# EAGLE design MainPCB_1P (EAGLE 9.4.2)
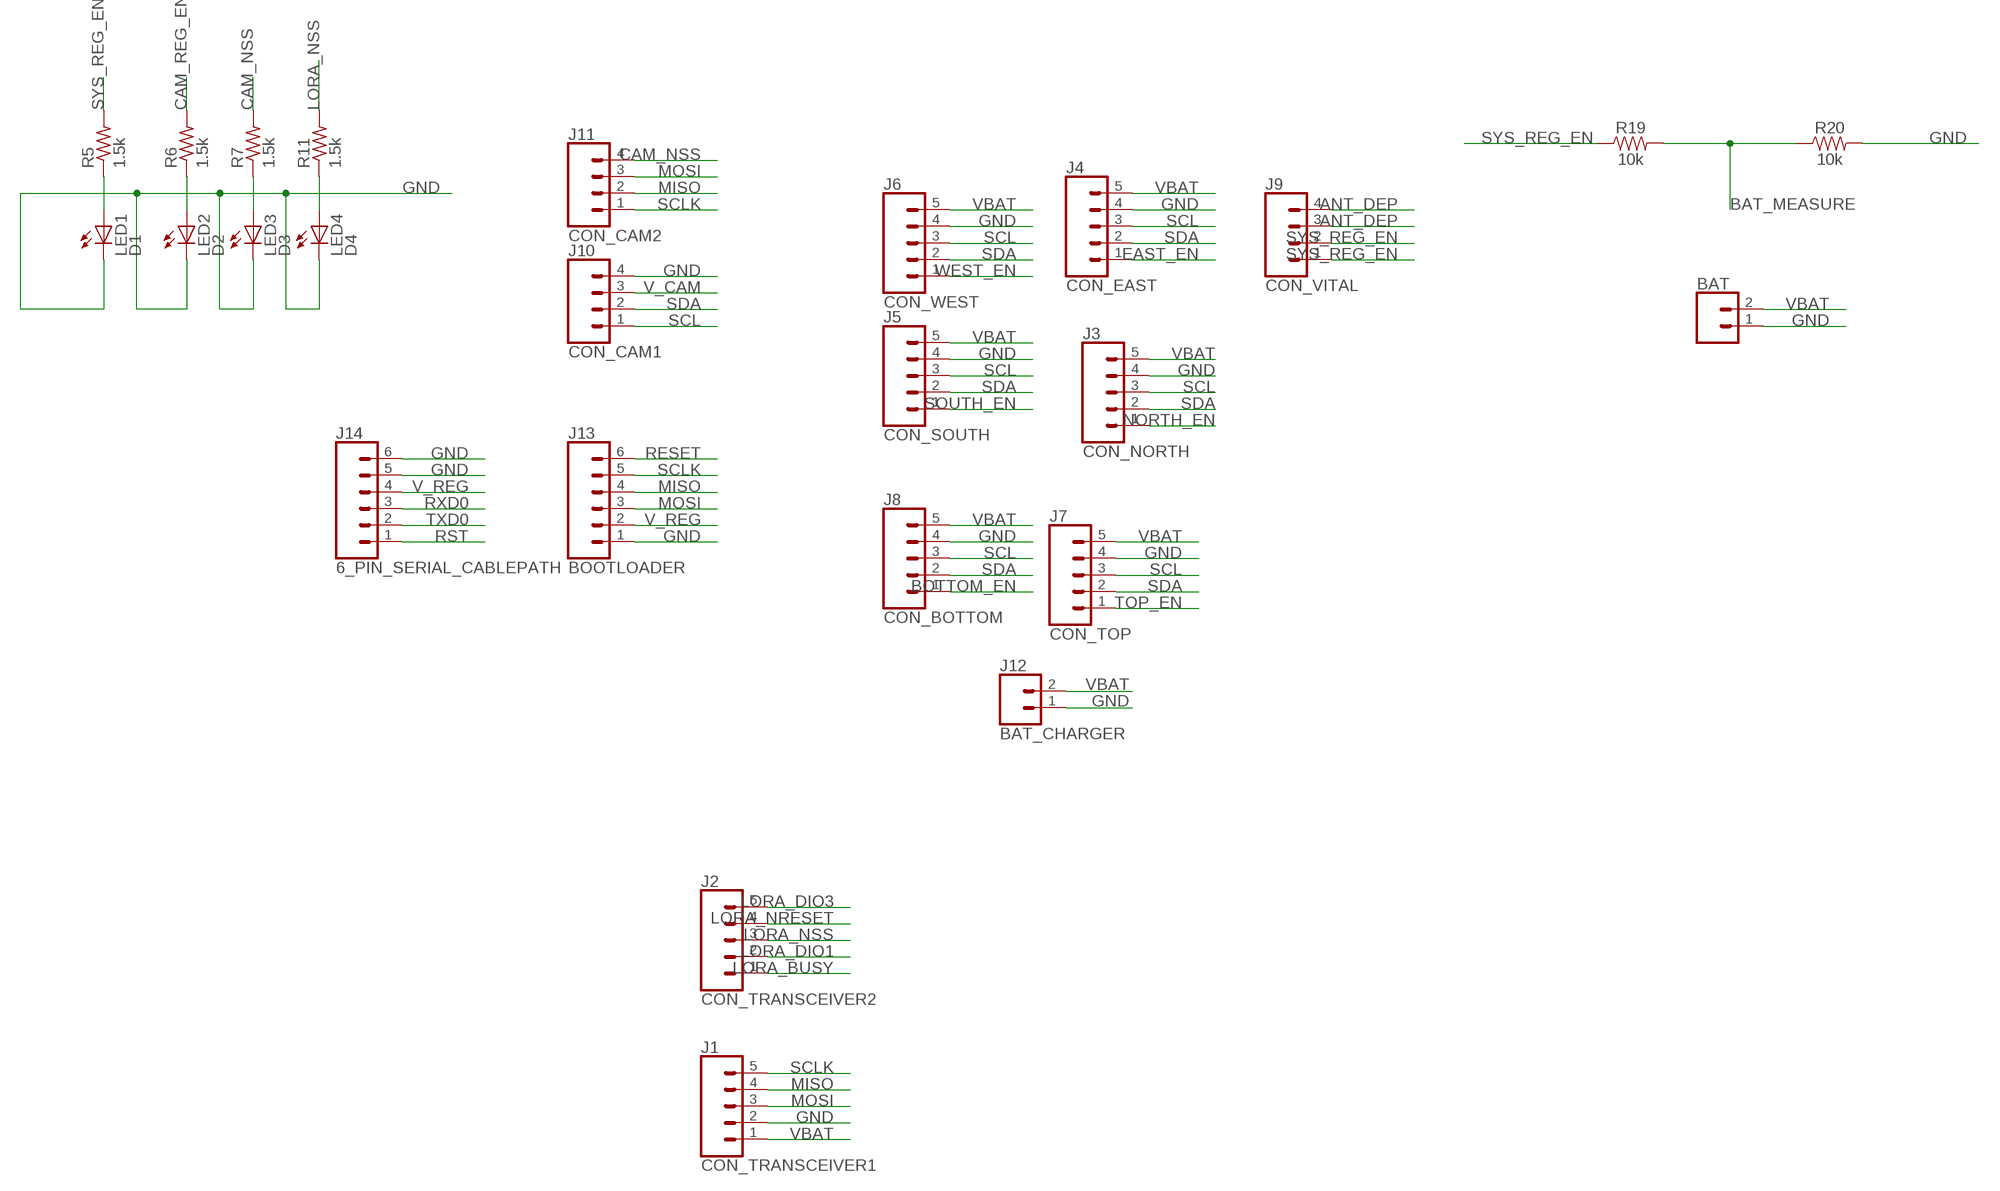
[diagram p0: schematic, sheet 1, part 1 of 2]
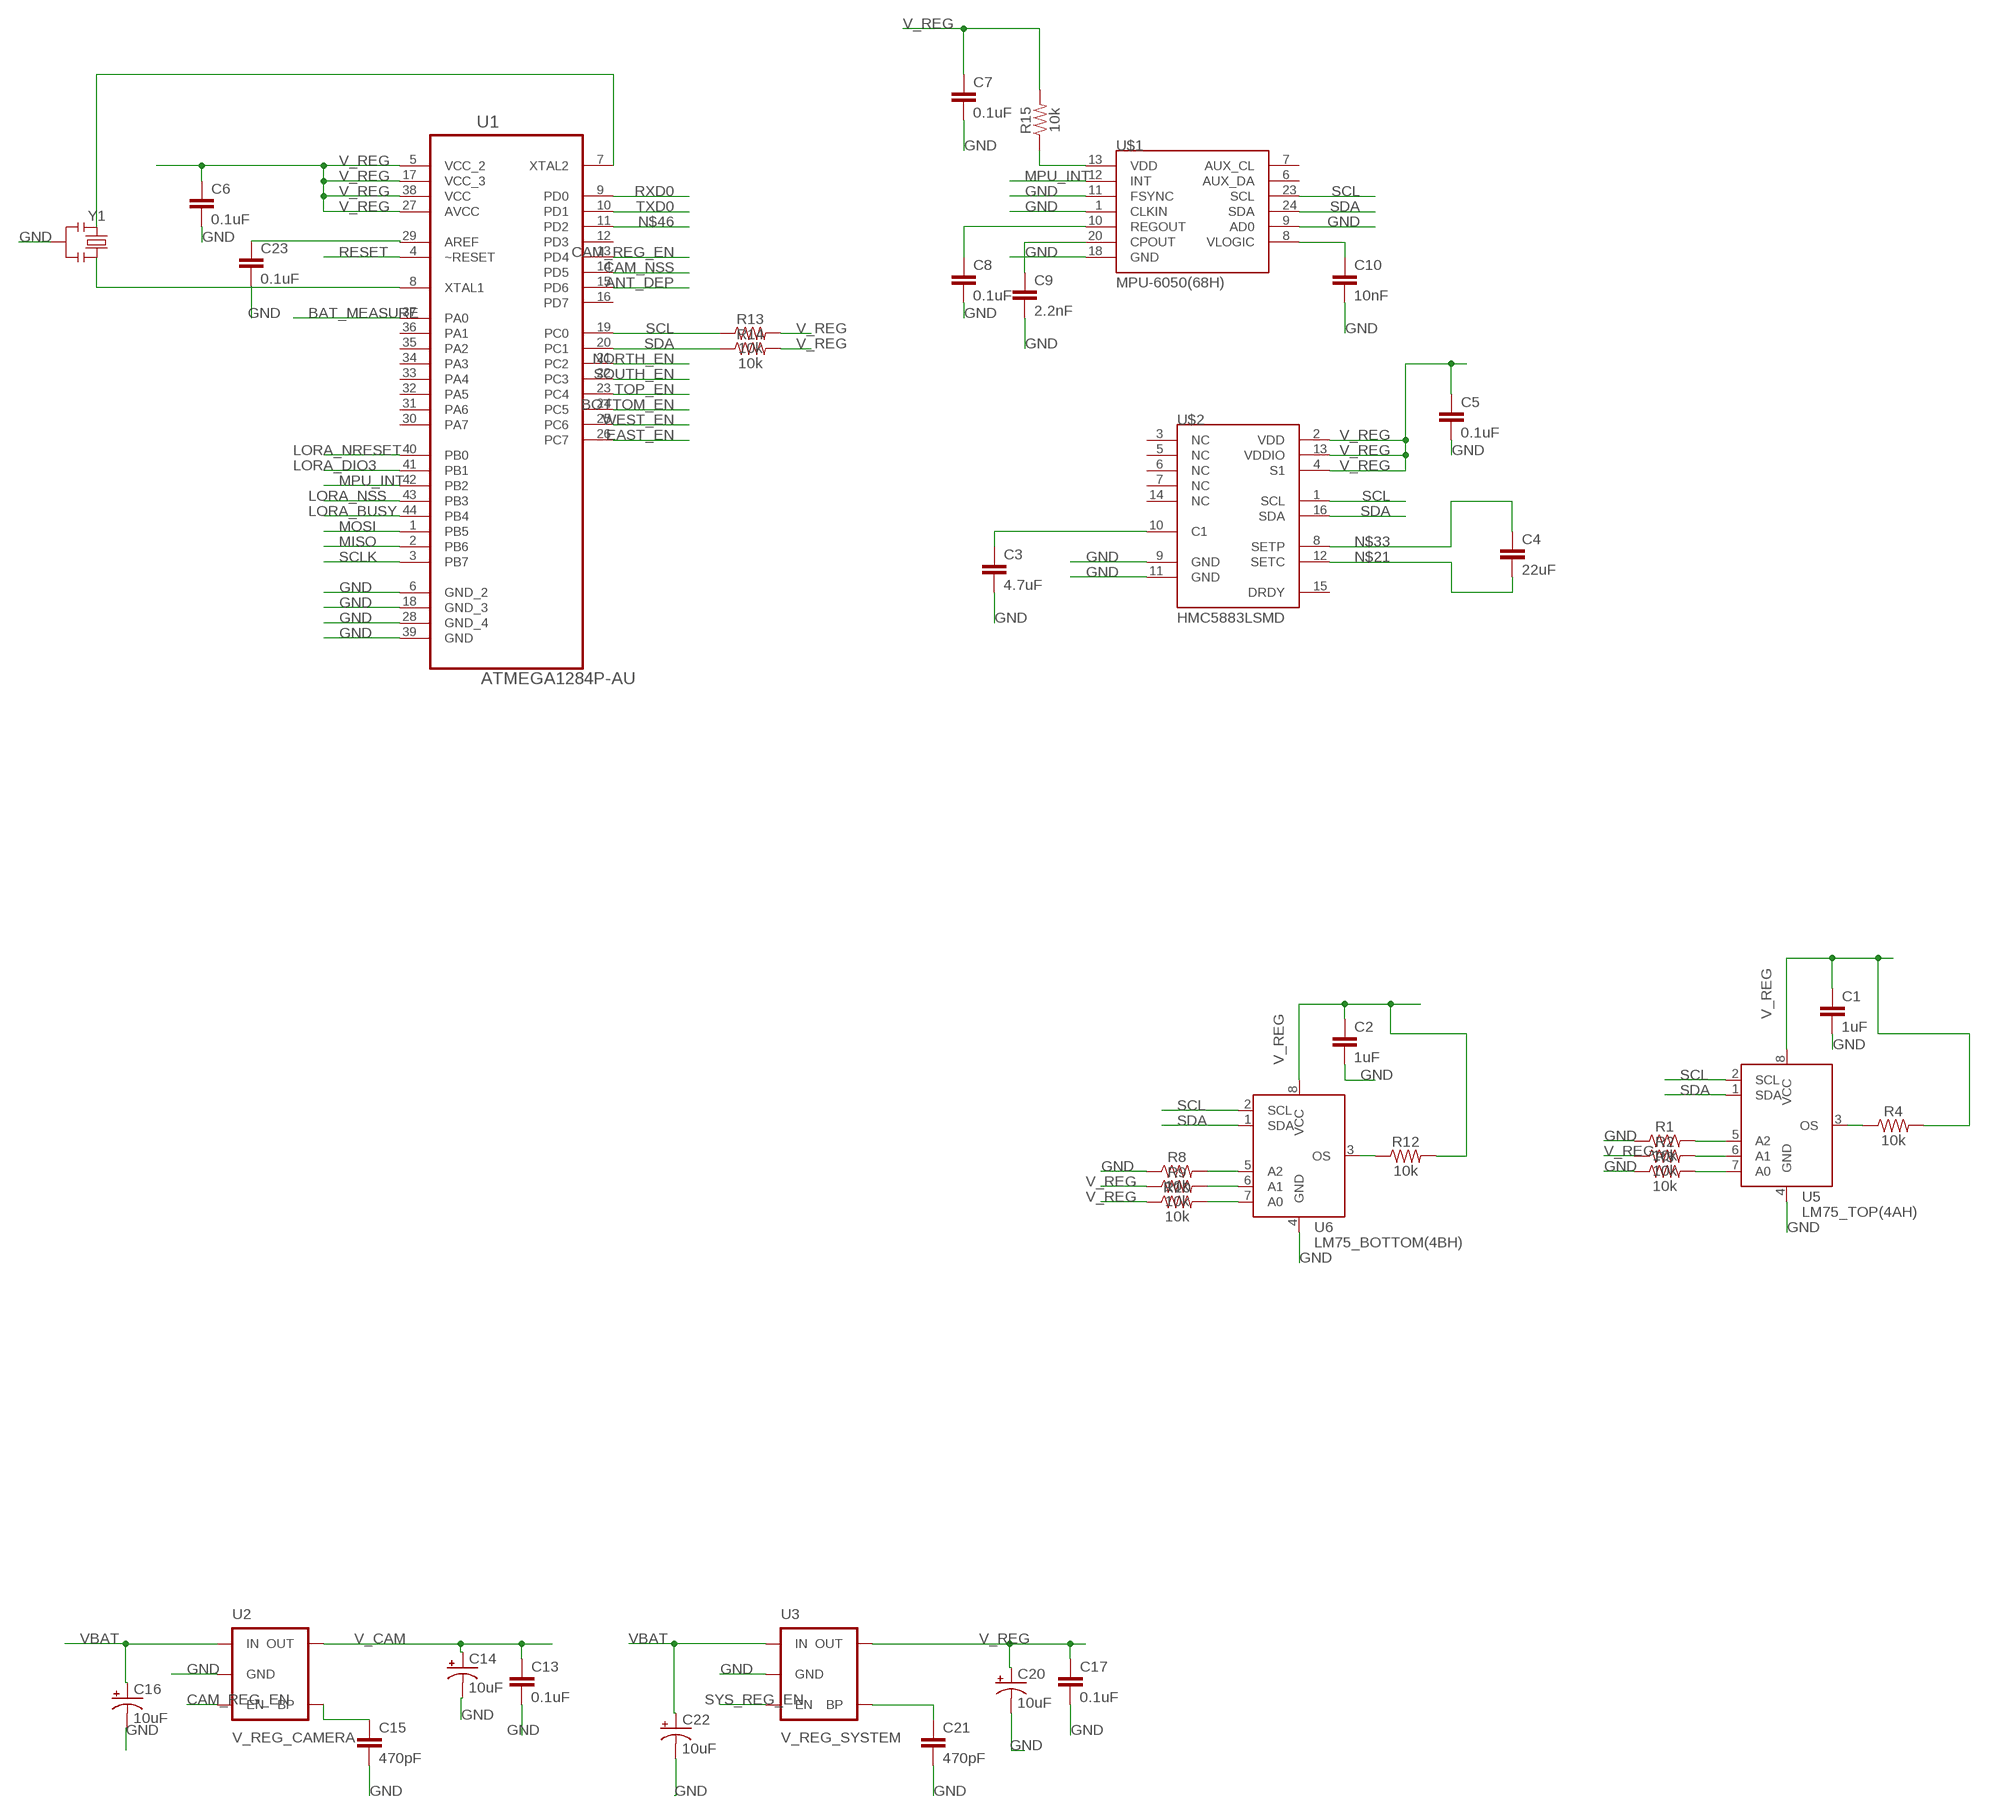
[diagram p1: schematic, sheet 1, part 2 of 2]

## Parts
BAT  CONN_02  [1X02]
C1  1uF  0.1UF-0603-25V-5%  [0603]
C2  1uF  0.1UF-0603-25V-5%  [0603]
C3  4.7uF  4.7UF-0603-35V-(20%)  [0603]
C4  22uF  22UF-0603-6.3V-20%  [0603]
C5  0.1uF  0.1UF-0603-100V-10%  [0603]
C6  0.1uF  0.1UF-0603-100V-10%  [0603]
C7  0.1uF  0.1UF-0603-100V-10%  [0603]
C8  0.1uF  0.1UF-0603-100V-10%  [0603]
C9  2.2nF  0.1UF-0603-100V-10%  [0603]
C10  10nF  0.1UF-0603-100V-10%  [0603]
C13  0.1uF  0.1UF-0603-100V-10%  [0603]
C14  10uF  10UF-POLAR-0603-6.3V-20%(TANT)  [0603-POLAR]
C15  470pF  0.1UF-0603-100V-10%  [0603]
C16  10uF  10UF-POLAR-0603-6.3V-20%(TANT)  [0603-POLAR]
C17  0.1uF  0.1UF-0603-100V-10%  [0603]
C20  10uF  10UF-POLAR-0603-6.3V-20%(TANT)  [0603-POLAR]
C21  470pF  0.1UF-0603-100V-10%  [0603]
C22  10uF  10UF-POLAR-0603-6.3V-20%(TANT)  [0603-POLAR]
C23  0.1uF  CAP0603-CAP  [0603-CAP]
J1  CON_TRANSCEIVER1  CONN_051.27MM  [1X05_1.27MM]
J2  CON_TRANSCEIVER2  CONN_051.27MM  [1X05_1.27MM]
J3  CON_NORTH  CONN_051.27MM  [1X05_1.27MM]
J4  CON_EAST  CONN_051.27MM  [1X05_1.27MM]
J5  CON_SOUTH  CONN_051.27MM  [1X05_1.27MM]
J6  CON_WEST  CONN_051.27MM  [1X05_1.27MM]
J7  CON_TOP  CONN_051.27MM  [1X05_1.27MM]
J8  CON_BOTTOM  CONN_051.27MM  [1X05_1.27MM]
J9  CON_VITAL  CONN_041.27MM  [1X04_1.27MM]
J10  CON_CAM1  CONN_041.27MM  [1X04_1.27MM]
J11  CON_CAM2  CONN_041.27MM  [1X04_1.27MM]
J12  BAT_CHARGER  CONN_021X02_NO_SILK  [1X02_NO_SILK]
J13  BOOTLOADER  CONN_061.27MM  [1X06_1.27MM]
J14  6_PIN_SERIAL_CABLEPATH  CONN_061.27MM  [1X06_1.27MM]
LED1  D1  LEDCHIP-LED0603  [CHIP-LED0603]
LED2  D2  LEDCHIP-LED0603  [CHIP-LED0603]
LED3  D3  LEDCHIP-LED0603  [CHIP-LED0603]
LED4  D4  LEDCHIP-LED0603  [CHIP-LED0603]
R1  10k  RESISTOR0603  [0603]
R2  10k  RESISTOR0603  [0603]
R3  10k  RESISTOR0603  [0603]
R4  10k  RESISTOR0603  [0603]
R5  1.5k  R-US_R0603  [R0603]
R6  1.5k  R-US_R0603  [R0603]
R7  1.5k  R-US_R0603  [R0603]
R8  10k  RESISTOR0603  [0603]
R9  10k  RESISTOR0603  [0603]
R10  10k  RESISTOR0603  [0603]
R11  1.5k  R-US_R0603  [R0603]
R12  10k  RESISTOR0603  [0603]
R13  10k  RESISTOR0603  [0603]
R14  10k  RESISTOR0603  [0603]
R15  10k  RESISTOR0603  [0603]
R19  10k  1KOHM-0603-1/10W-1%  [0603]
R20  10k  1KOHM-0603-1/10W-1%  [0603]
U1  ATMEGA1284P-AU  [QFP80P1200X1200X120-44N]
U2  V_REG_CAMERA  V_REG_LDOSMD  [SOT23-5]
U3  V_REG_SYSTEM  V_REG_LDOSMD  [SOT23-5]
U5  LM75_TOP(4AH)  LM75BDP  [SOT505-1]
U6  LM75_BOTTOM(4BH)  LM75BDP  [SOT505-1]
U$1  MPU-6050(68H)  MPU-6050-1  [QFN-24-4MM2]
U$2  HMC5883LSMD  [16LPCC]
Y1  RESONATORSMD  [RESONATOR-SMD]

## Nets
ANT_DEP: J9.3 J9.4 U1.15(PD6)
BAT_MEASURE: R19.2 R20.1 U1.37(PA0)
BOTTOM_EN: J8.1 U1.24(PC5)
CAM_NSS: J11.4 R7.2 U1.14(PD5)
CAM_REG_EN: R6.2 U1.13(PD4) U2.3(EN)
EAST_EN: J4.1 U1.26(PC7)
GND: BAT.1 C1.2 C2.2 C3.2 C5.2 C6.2 C7.2 C8.2 C9.2 C10.2 C13.2 C14.- C15.2 C16.- C17.2 C20.- C21.2 C22.- C23.2 J1.2 J3.4 J4.4 J5.4 J6.4 J7.4 J8.4 J10.4 J12.1 J13.1 J14.5 J14.6 LED1.C LED2.C LED3.C LED4.C R1.1 R3.1 R8.1 R20.2 U1.6(GND_2) U1.18(GND_3) U1.28(GND_4) U1.39(GND) U2.2(GND) U3.2(GND) U5.4(GND) U6.4(GND) U$1.1(CLKIN) U$1.9(AD0) U$1.11(FSYNC) U$1.18(GND) U$2.9(GND) U$2.11(GND) Y1.2
LORA_BUSY: J2.1 U1.44(PB4)
LORA_DIO1: J2.2
LORA_DIO3: J2.5 U1.41(PB1)
LORA_NRESET: J2.4 U1.40(PB0)
LORA_NSS: J2.3 R11.2 U1.43(PB3)
MISO: J1.4 J11.2 J13.4 U1.2(PB6)
MOSI: J1.3 J11.3 J13.3 U1.1(PB5)
MPU_INT: U1.42(PB2) U$1.12(INT)
N$1: C23.1 U1.29(AREF)
N$2: R1.2 U5.5(A2)
N$4: U1.7(XTAL2) Y1.1
N$5: U1.8(XTAL1) Y1.3
N$7: C3.1 U$2.10(C1)
N$8: C9.1 U$1.20(CPOUT)
N$9: C8.1 U$1.10(REGOUT)
N$10: R15.1 U$1.13(VDD)
N$11: R2.2 U5.6(A1)
N$13: C10.1 U$1.8(VLOGIC)
N$14: R8.2 U6.5(A2)
N$15: R9.2 U6.6(A1)
N$16: R10.2 U6.7(A0)
N$17: R3.2 U5.7(A0)
N$21: C4.2 U$2.12(SETC)
N$24: R4.1 U5.3(OS)
N$27: C21.1 U3.4(BP)
N$28: LED1.A R5.1
N$29: LED2.A R6.1
N$30: C15.1 U2.4(BP)
N$31: LED3.A R7.1
N$32: LED4.A R11.1
N$33: C4.1 U$2.8(SETP)
N$46: U1.11(PD2)
N$52: R12.1 U6.3(OS)
NORTH_EN: J3.1 U1.21(PC2)
RESET: J13.6 U1.4(~RESET)
RST: J14.1
RXD0: J14.3 U1.9(PD0)
SCL: J3.3 J4.3 J5.3 J6.3 J7.3 J8.3 J10.1 R13.1 U1.19(PC0) U5.2(SCL) U6.2(SCL) U$1.23(SCL) U$2.1(SCL)
SCLK: J1.5 J11.1 J13.5 U1.3(PB7)
SDA: J3.2 J4.2 J5.2 J6.2 J7.2 J8.2 J10.2 R14.1 U1.20(PC1) U5.1(SDA) U6.1(SDA) U$1.24(SDA) U$2.16(SDA)
SOUTH_EN: J5.1 U1.22(PC3)
SYS_REG_EN: J9.1 J9.2 R5.2 R19.1 U3.3(EN)
TOP_EN: J7.1 U1.23(PC4)
TXD0: J14.2 U1.10(PD1)
V_CAM: C13.1 C14.+ J10.3 U2.5(OUT)
V_REG: C1.1 C2.1 C5.1 C6.1 C7.1 C17.1 C20.+ J13.2 J14.4 R2.1 R4.2 R9.1 R10.1 R12.2 R13.2 R14.2 R15.2 U1.5(VCC_2) U1.17(VCC_3) U1.27(AVCC) U1.38(VCC) U3.5(OUT) U5.8(VCC) U6.8(VCC) U$2.2(VDD) U$2.4(S1) U$2.13(VDDIO)
VBAT: BAT.2 C16.+ C22.+ J1.1 J3.5 J4.5 J5.5 J6.5 J7.5 J8.5 J12.2 U2.1(IN) U3.1(IN)
WEST_EN: J6.1 U1.25(PC6)
Unconnected: U1.12(PD3) U1.16(PD7) U1.30(PA7) U1.31(PA6) U1.32(PA5) U1.33(PA4) U1.34(PA3) U1.35(PA2) U1.36(PA1) U$1.6(AUX_DA) U$1.7(AUX_CL) U$2.3(NC) U$2.5(NC) U$2.6(NC) U$2.7(NC) U$2.14(NC) U$2.15(DRDY)

## Library data of the parts
BAT J12 = SparkFun-Connectors:CONN_02: Multi connection point. Often used as Generic Header-pin footprint for 0.1 inch spaced/style header connections On any of the 0.1 inch spaced packages, you can populate with these: Break Away Headers - Straight <https://www.sparkfun.com/products/116> (PRT-00116) Break Away Male Headers - Right Angle <https://www.sparkfun.com/products/553> (PRT-00553) Female Headers <https://www.sparkfun.com/products/115> (PRT-00115) Break Away Headers - Machine Pin <https://www.sparkfun.com/products/117> (PRT-00117) Break Away Female Headers - Swiss Machine Pin <https://www.sparkfun.com/products/743> (PRT-00743) For SCREWTERMINALS and SPRING TERMINALS visit here: Screw Terimnals on SparkFun.com <https://www.sparkfun.com/search/results?term=Screw+Terminals> (5mm/3.5mm/2.54mm spacing) This device is also useful as a general connection point to wire up your design to another part of your project. Our various solder wires solder well into these plated through hole pads. Hook-Up Wire - Assortment (Stranded, 22 AWG) <https://www.sparkfun.com/products/11375> (PRT-11375) Hook-Up Wire - Assortment (Solid Core, 22 AWG) <https://www.sparkfun.com/products/11367> (PRT-11367) View the entire wire category on our website here <https://www.sparkfun.com/categories/141> Special notes: Molex polarized connector foot print use with: PRT-08233 with associated crimp pins and housings. 2.54_SCREWTERM for use with PRT-10571. 3.5mm Screw Terminal footprints for PRT-08084 5mm Screw Terminal footprints for use with PRT-08432
C1 C2 = SparkFun-Capacitors:0.1UF: 0.1µF ceramic capacitors A capacitor is a passive two-terminal electrical component used to store electrical energy temporarily in an electric field.; PROD_ID: CAP-08604; VALUE: 0.1uF
C3 = SparkFun-Capacitors:4.7UF: 4.7µF ceramic capacitors A capacitor is a passive two-terminal electrical component used to store electrical energy temporarily in an electric field.; PROD_ID: CAP-14106
C4 = SparkFun-Capacitors:22UF: 22µF ceramic capacitors A capacitor is a passive two-terminal electrical component used to store electrical energy temporarily in an electric field.; PROD_ID: CAP-14464
C5-C8 C13 C17 = SparkFun-Capacitors:0.1UF: 0.1µF ceramic capacitors A capacitor is a passive two-terminal electrical component used to store electrical energy temporarily in an electric field.; PROD_ID: CAP-08390
C9 C10 C15 C21 = SparkFun-Capacitors:0.1UF: 0.1µF ceramic capacitors A capacitor is a passive two-terminal electrical component used to store electrical energy temporarily in an electric field.; PROD_ID: CAP-08390; VALUE: 0.1uF
C14 C16 C20 C22 = SparkFun-Capacitors:10UF-POLAR: 10.0µF polarized capacitors A capacitor is a passive two-terminal electrical component used to store electrical energy temporarily in an electric field.; PROD_ID: CAP-13210
C23 = SparkFun:CAP: Capacitor Standard 0603 ceramic capacitor, and 0.1" leaded capacitor.
J1-J8 = SparkFun-Connectors:CONN_05: Multi connection point. Often used as Generic Header-pin footprint for 0.1 inch spaced/style header connections On any of the 0.1 inch spaced packages, you can populate with these: Break Away Headers - Straight <https://www.sparkfun.com/products/116> (PRT-00116) Break Away Male Headers - Right Angle <https://www.sparkfun.com/products/553> (PRT-00553) Female Headers <https://www.sparkfun.com/products/115> (PRT-00115) Break Away Headers - Machine Pin <https://www.sparkfun.com/products/117> (PRT-00117) Break Away Female Headers - Swiss Machine Pin <https://www.sparkfun.com/products/743> (PRT-00743) For SCREWTERMINALS and SPRING TERMINALS visit here: Screw Terimnals on SparkFun.com <https://www.sparkfun.com/search/results?term=Screw+Terminals> (5mm/3.5mm/2.54mm spacing) This device is also useful as a general connection point to wire up your design to another part of your project. Our various solder wires solder well into these plated through hole pads. Hook-Up Wire - Assortment (Stranded, 22 AWG) <https://www.sparkfun.com/products/11375> (PRT-11375) Hook-Up Wire - Assortment (Solid Core, 22 AWG) <https://www.sparkfun.com/products/11367> (PRT-11367) View the entire wire category on our website here <https://www.sparkfun.com/categories/141> Special notes: Molex polarized connector foot print use with SKU : PRT-08231 with associated crimp pins and housings. 1MM SMD Version SKU: PRT-10208
J9-J11 = SparkFun-Connectors:CONN_04: Multi connection point. Often used as Generic Header-pin footprint for 0.1 inch spaced/style header connections On any of the 0.1 inch spaced packages, you can populate with these: Break Away Headers - Straight <https://www.sparkfun.com/products/116> (PRT-00116) Break Away Male Headers - Right Angle <https://www.sparkfun.com/products/553> (PRT-00553) Female Headers <https://www.sparkfun.com/products/115> (PRT-00115) Break Away Headers - Machine Pin <https://www.sparkfun.com/products/117> (PRT-00117) Break Away Female Headers - Swiss Machine Pin <https://www.sparkfun.com/products/743> (PRT-00743) For SCREWTERMINALS and SPRING TERMINALS visit here: Screw Terimnals on SparkFun.com <https://www.sparkfun.com/search/results?term=Screw+Terminals> (5mm/3.5mm/2.54mm spacing) This device is also useful as a general connection point to wire up your design to another part of your project. Our various solder wires solder well into these plated through hole pads. Hook-Up Wire - Assortment (Stranded, 22 AWG) <https://www.sparkfun.com/products/11375> (PRT-11375) Hook-Up Wire - Assortment (Solid Core, 22 AWG) <https://www.sparkfun.com/products/11367> (PRT-11367) View the entire wire category on our website here <https://www.sparkfun.com/categories/141> Special notes: Molex polarized connector foot print use with SKU : PRT-08231 with associated crimp pins and housings. 1MM SMD Version SKU: PRT-10208
J13 J14 = SparkFun-Connectors:CONN_06: Multi connection point. Often used as Generic Header-pin footprint for 0.1 inch spaced/style header connections On any of the 0.1 inch spaced packages, you can populate with these: Break Away Headers - Straight <https://www.sparkfun.com/products/116> (PRT-00116) Break Away Male Headers - Right Angle <https://www.sparkfun.com/products/553> (PRT-00553) Female Headers <https://www.sparkfun.com/products/115> (PRT-00115) Break Away Headers - Machine Pin <https://www.sparkfun.com/products/117> (PRT-00117) Break Away Female Headers - Swiss Machine Pin <https://www.sparkfun.com/products/743> (PRT-00743) Arduino Stackable Header - 6 Pin <https://www.sparkfun.com/products/9280> (PRT-09280) For SCREWTERMINALS and SPRING TERMINALS visit here: Screw Terimnals on SparkFun.com <https://www.sparkfun.com/search/results?term=Screw+Terminals> (5mm/3.5mm/2.54mm spacing) This device is also useful as a general connection point to wire up your design to another part of your project. Our various solder wires solder well into these plated through hole pads. Hook-Up Wire - Assortment (Stranded, 22 AWG) <https://www.sparkfun.com/products/11375> (PRT-11375) Hook-Up Wire - Assortment (Solid Core, 22 AWG) <https://www.sparkfun.com/products/11367> (PRT-11367) View the entire wire category on our website here <https://www.sparkfun.com/categories/141>
LED1-LED4 = adafruit:LED: LED OSRAM: - CHIPLED LG R971, LG N971, LY N971, LG Q971, LY Q971, LO R971, LY R971 LH N974, LH R974 LS Q976, LO Q976, LY Q976 LO Q996 - Hyper CHIPLED LW Q18S LB Q993, LB Q99A, LB R99A - SideLED LS A670, LO A670, LY A670, LG A670, LP A670 LB A673, LV A673, LT A673, LW A673 LH A674 LY A675 LS A676, LA A676, LO A676, LY A676, LW A676 LS A679, LY A679, LG A679 - Hyper Micro SIDELED® LS Y876, LA Y876, LO Y876, LY Y876 LT Y87S - SmartLED LW L88C, LW L88S LB L89C, LB L89S, LG L890 LS L89K, LO L89K, LY L89K LS L896, LA L896, LO L896, LY L896 - TOPLED LS T670, LO T670, LY T670, LG T670, LP T670 LSG T670, LSP T670, LSY T670, LOP T670, LYG T670 LG T671, LOG T671, LSG T671 LB T673, LV T673, LT T673, LW T673 LH T674 LS T676, LA T676, LO T676, LY T676, LB T676, LH T676, LSB T676, LW T676 LB T67C, LV T67C, LT T67C, LS T67K, LO T67K, LY T67K, LW E67C LS E67B, LA E67B, LO E67B, LY E67B, LB E67C, LV E67C, LT E67C LW T67C LS T679, LY T679, LG T679 LS T770, LO T770, LY T770, LG T770, LP T770 LB T773, LV T773, LT T773, LW T773 LH T774 LS E675, LA E675, LY E675, LS T675 LS T776, LA T776, LO T776, LY T776, LB T776 LHGB T686 LT T68C, LB T68C - Hyper Mini TOPLED® LB M676 - Mini TOPLED Santana® LG M470 LS M47K, LO M47K, LY M47K Source: http://www.osram.convergy.de/
R1-R4 R8-R10 R12-R15 = SparkFun-Resistors:RESISTOR: Generic Resistor Package
R5-R7 R11 = adafruit:R-US_: RESISTOR, American symbol
R19 R20 = SparkFun-Resistors:1KOHM: 1kΩ resistor A resistor is a passive two-terminal electrical component that implements electrical resistance as a circuit element. Resistors act to reduce current flow, and, at the same time, act to lower voltage levels within circuits. - Wikipedia; PROD_ID: RES-07856; VALUE: 1k
U1 = MainCPCB003:ATMEGA1284P-AU: Microcontroller with Programmable Flash; AVAILABILITY: Unavailable; DESCRIPTION: AVR AVR® ATmega Microcontroller IC 8-Bit 20MHz 128KB _64K x 16_ FLASH 44-TQFP _10x10_; MF: Microchip; MP: ATMEGA1284P-AU; PACKAGE: TQFP-44 Microchip; PRICE: None
U2 U3 = MainCPCB003:V_REG_LDO: Voltage Regulator LDO Standard 150mA LDO voltage regulator in SOT-23 layout. Micrel part MIC5205. BP (by-pass) pin is used to lower output noise with 470pF cap.
U5 U6 = MainCPCB003:LM75B: Digital temperature sensor and thermal watchdog AAL Eindhoven MK; AVAILABILITY: Unavailable; MF: NXP Semiconductors; MP: LM75B; PACKAGE: None; PRICE: None
U$1 = MainCPCB003:MPU-6050
U$2 = MainCPCB003:HMC5883L: 3 Axis Digital Compass IC
Y1 = SparkFun:RESONATOR: Resonator Small SMD resonator. This is the itty bitty 10/20MHz resonators with built in caps. CSTCE10M0G55 and CSTCE20M0V53. Footprint has been reviewed closely but hasn't been tested yet.

## Board
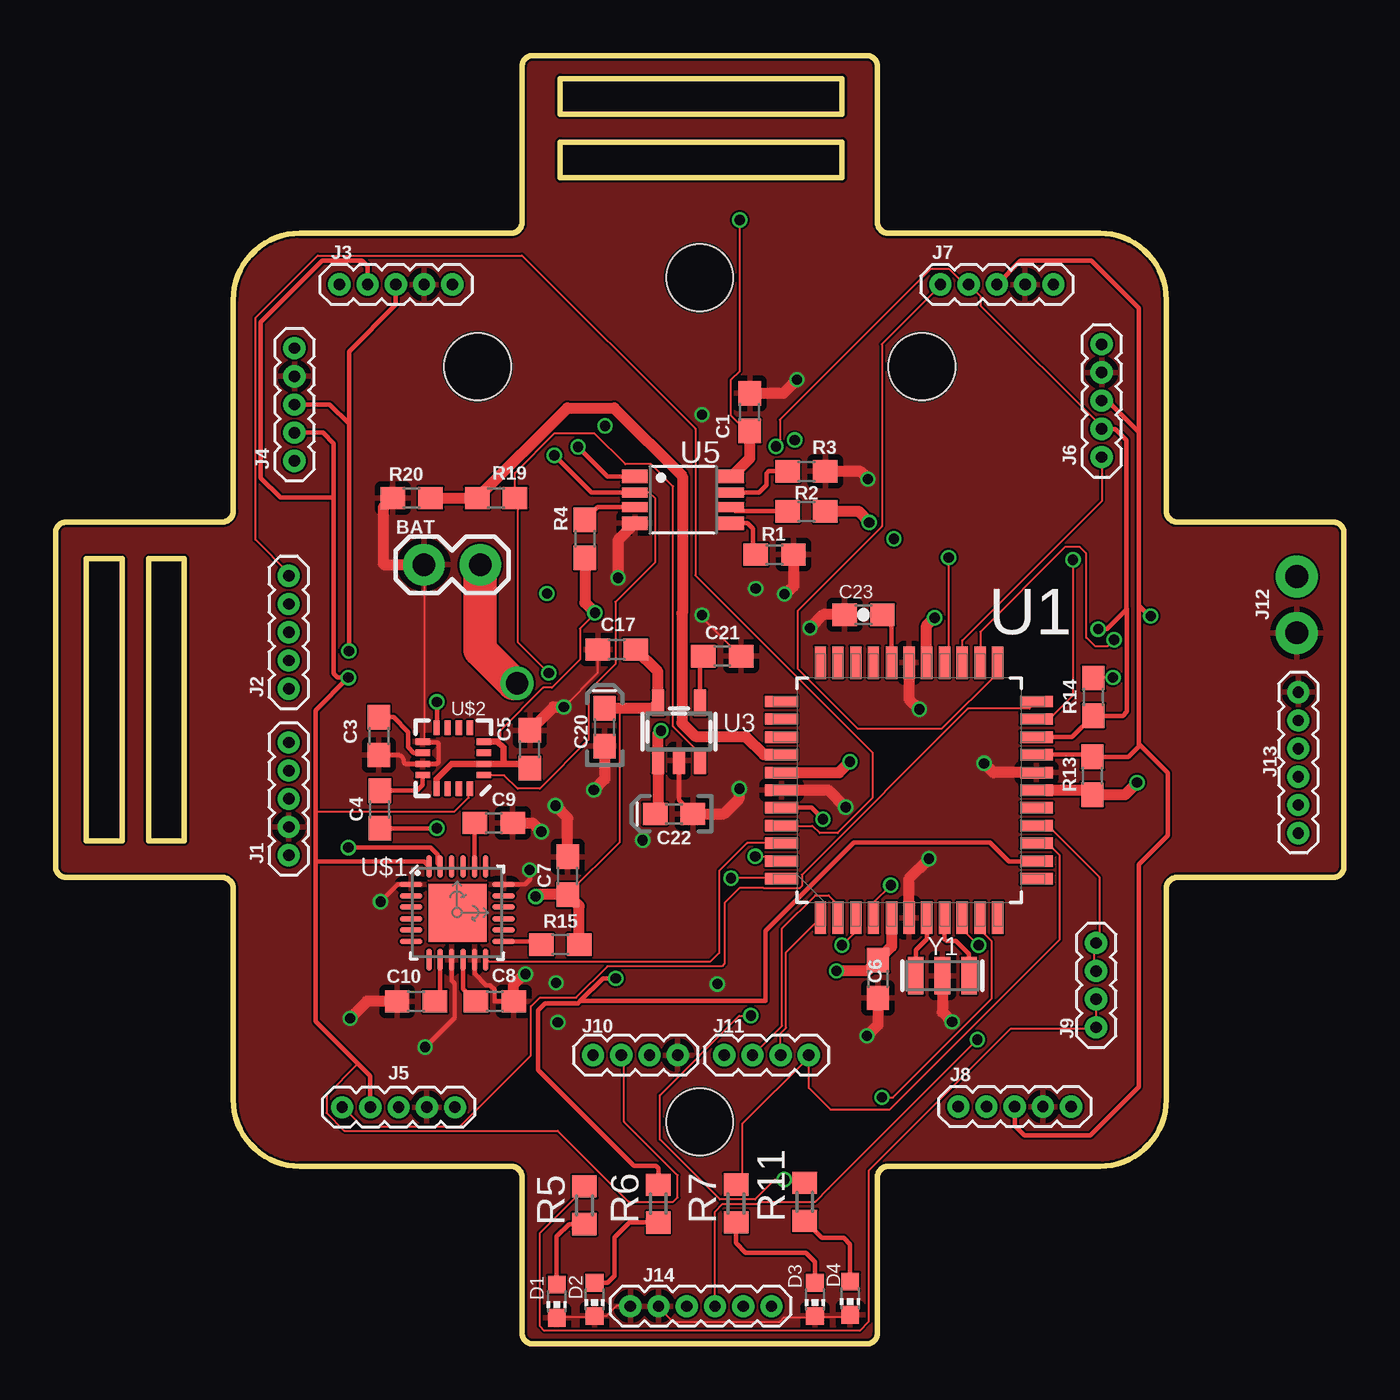
[diagram p2: board, top side]
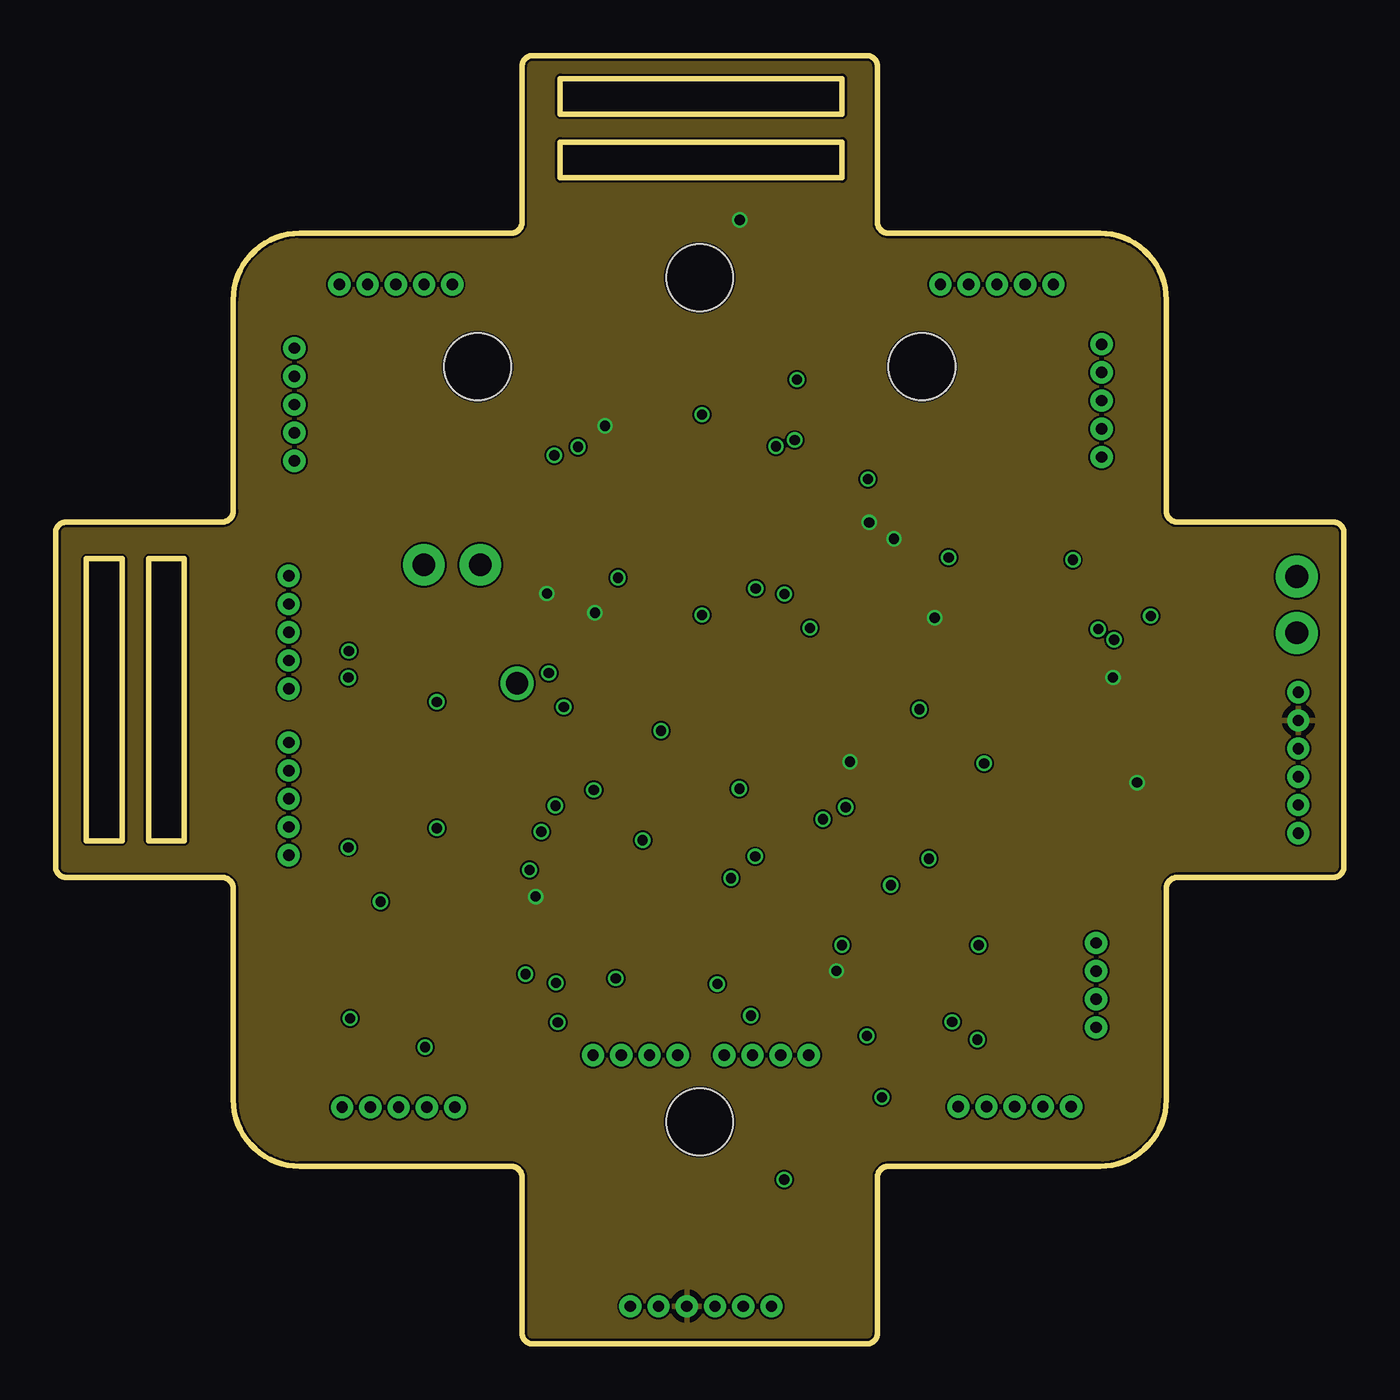
[diagram p3: board, inner layer Route2]
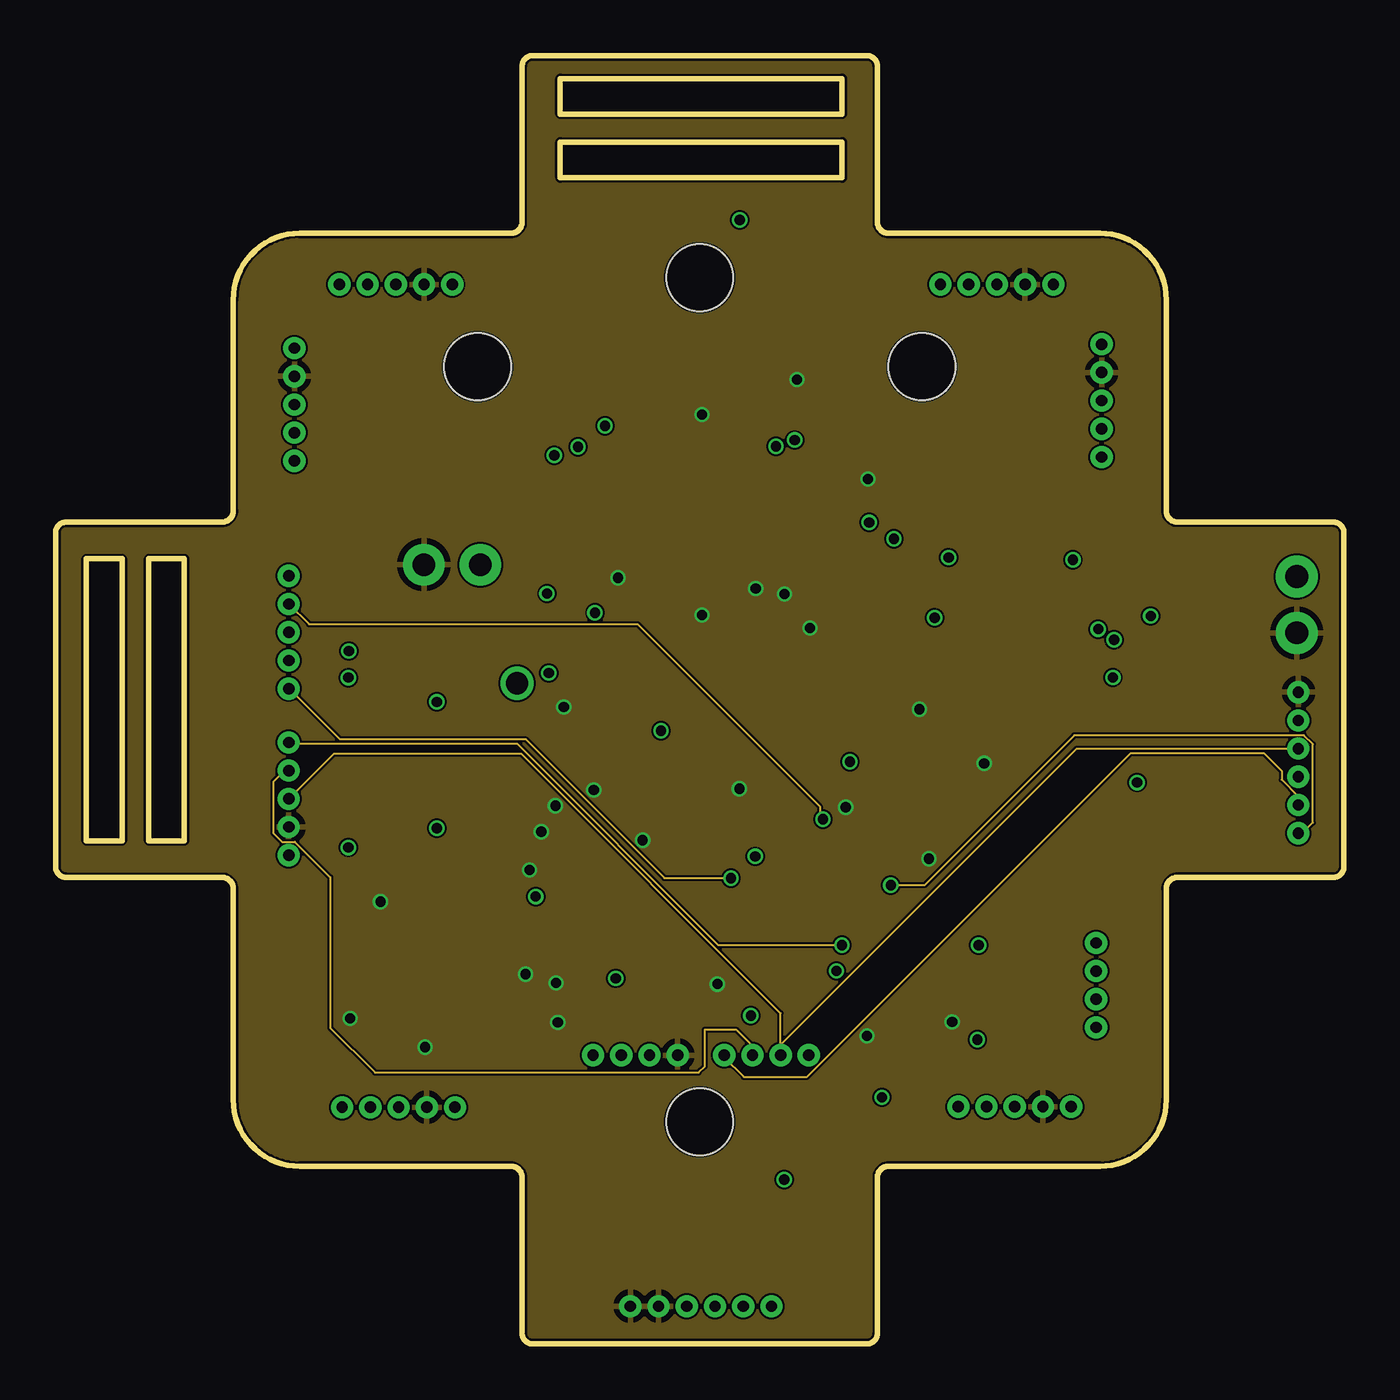
[diagram p4: board, inner layer Route15]
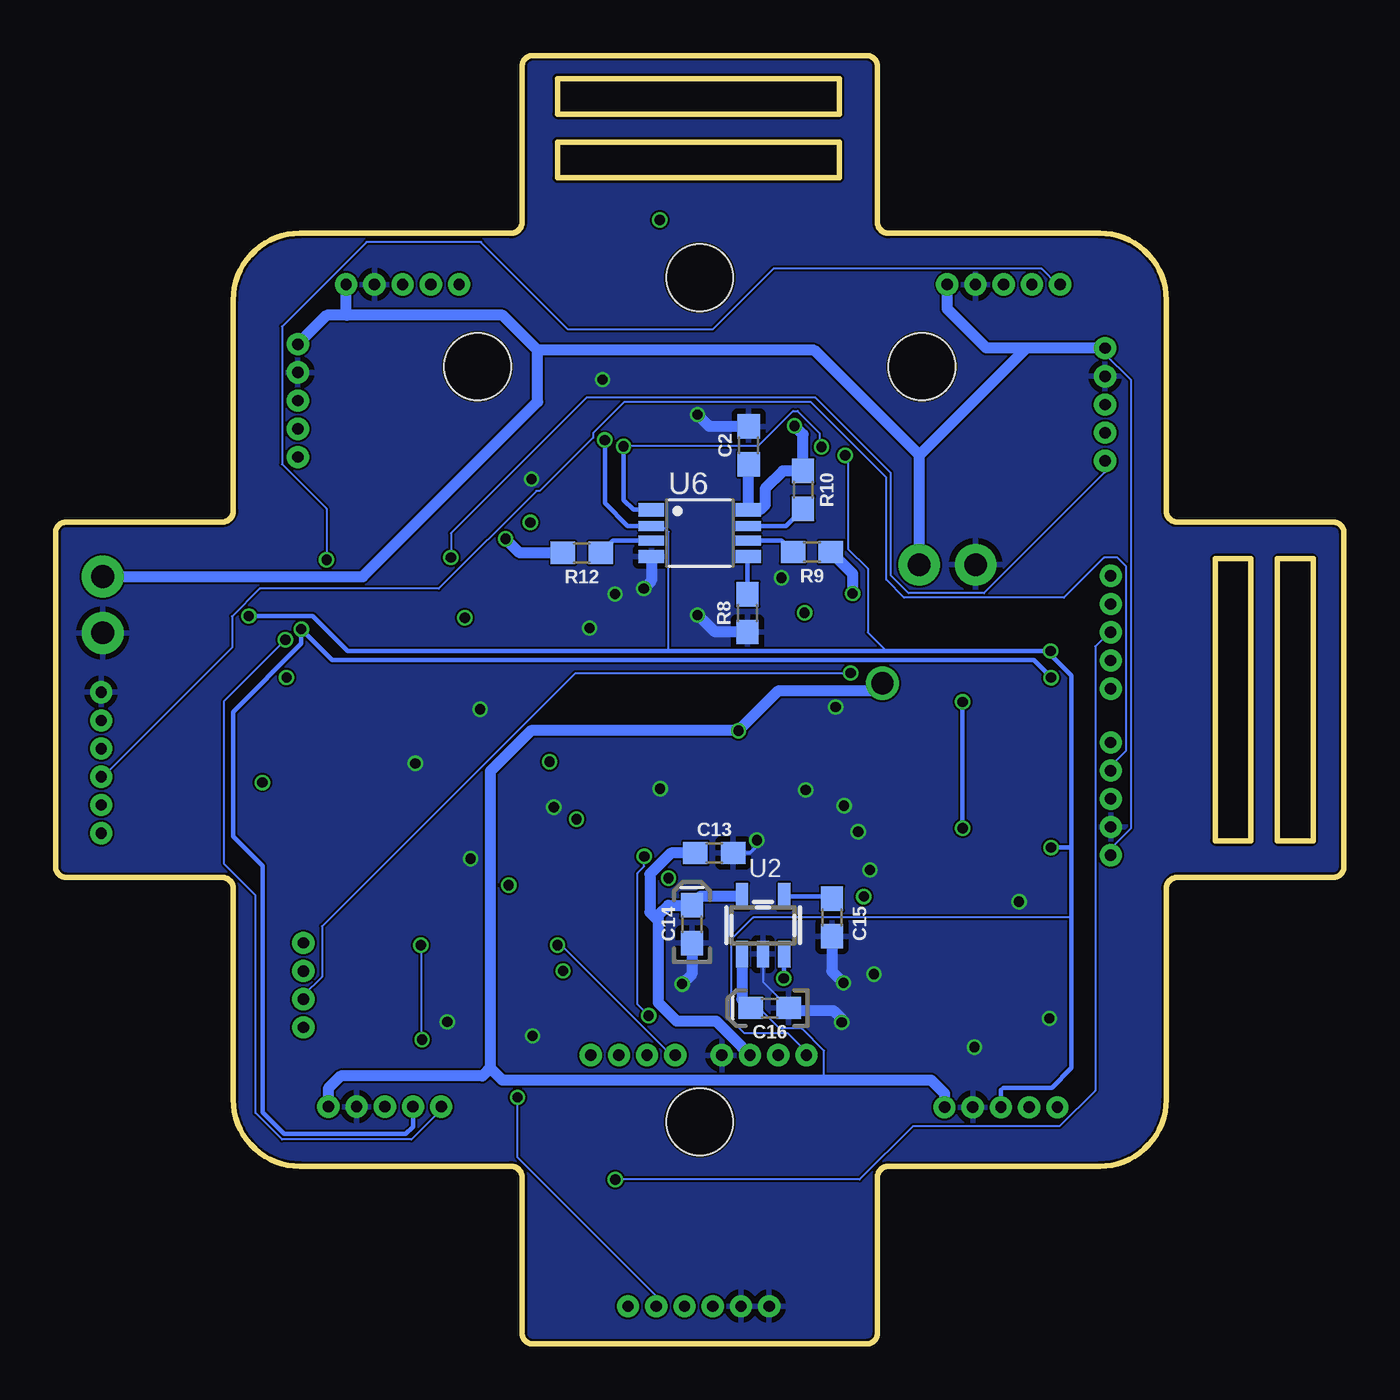
[diagram p5: board, bottom side, seen from below]

Size 58 x 58 mm. Coordinates in mm from the lower left corner, seen from the top.
Outline: 0.5,37 7.5,37 arc90 8,37.5 8,47 arc-90 11,50 20.5,50 arc90 21,50.5 21,57.5 arc-90 21.5,58 36.5,58 arc-90 37,57.5 37,50.5 arc90 37.5,50 47,50 arc-90 50,47 50,37.5 arc90 50.5,37 57.5,37 arc-90 58,36.5 58,21.5 arc-90 57.5,21 50.5,21 arc90 50,20.5 50,11 arc-90 47,8 37.5,8 arc90 37,7.5 37,0.5 arc-90 36.5,0 21.5,0 arc-90 21,0.5 21,7.5 arc90 20.5,8 11,8 arc-90 8,11 8,20.5 arc90 7.5,21 0.5,21 arc-90 0,21.5 0,36.5 arc-90 0.5,37
Outline: 2.99,35.35 2.99,22.65 1.39,22.65 1.39,35.35 2.99,35.35
Outline: 5.8,35.35 5.8,22.65 4.2,22.65 4.2,35.35 5.8,35.35
Outline: 22.71,54.1 35.41,54.1 35.41,52.5 22.71,52.5 22.71,54.1
Outline: 22.71,56.97 35.41,56.97 35.41,55.37 22.71,55.37 22.71,56.97
Copper layers (1+2*15+16): Top 0.035mm / dielectric 0.2mm / Route2 0.0175mm / dielectric 1.065mm / Route15 0.0175mm / dielectric 0.2mm / Bottom 0.035mm
Design rules "jlcpcb-4-layer_JLC7628-stackup *": minimum track width 3.5mil, minimum drill 0.46mm, track to track 3.5mil, track to pad 5mil, pad to pad 5mil, via to via 5mil, smd to smd 0mil, copper to edge 0.1mm, drill to drill 5mil, minimum pad ring 4mil, minimum via ring 4mil, stop-mask expansion 3mil, vias tented up to drill 100mil, thermal gap 10mil
Holes 3 mm at 29,48 29,10 19,44 39,44

### Footprints (pad centres in the part's own frame; a part is rotated, then mirrored left to right if it is on the bottom)
1X02 = drill 1.016 pad 1.88: 1 0,0; 2 2.54,0
0603 = smd 1.1 x 1: 1 -0.85,0; 2 0.85,0
0603-POLAR = smd 1.1 x 1: + 0.85,0; - -0.85,0
0603-CAP = smd 1.1 x 1: 1 -0.85,0; 2 0.85,0
1X05_1.27MM = drill 0.508 pad 1: 1 0,0; 2 1.27,0; 3 2.54,0; 4 3.81,0; 5 5.08,0
1X04_1.27MM = drill 0.508 pad 1: 1 0,0; 2 1.27,0; 3 2.54,0; 4 3.81,0
1X02_NO_SILK = drill 1.016 pad 1.88: 1 0,0; 2 2.54,0
1X06_1.27MM = drill 0.508 pad 1: 1 0,0; 2 1.27,0; 3 2.54,0; 4 3.81,0; 5 5.08,0; 6 6.35,0
CHIP-LED0603 = smd 0.8 x 0.8: A 0,-0.75; C 0,0.75
R0603 = smd 1 x 1.1: 1 -0.85,0; 2 0.85,0
QFP80P1200X1200X120-44N = smd 1.473 x 0.508: 1 -5.74,3.988; 2 -5.74,3.2; 3 -5.74,2.388; 4 -5.74,1.6; 5 -5.74,0.787; 6 -5.74,0; 7 -5.74,-0.787; 8 -5.74,-1.6; 9 -5.74,-2.388; 10 -5.74,-3.2; 11 -5.74,-3.988; 23 5.74,-3.988; 24 5.74,-3.2; 25 5.74,-2.388; 26 5.74,-1.6; 27 5.74,-0.787; 28 5.74,0; 29 5.74,0.787; 30 5.74,1.6; 31 5.74,2.388; 32 5.74,3.2; 33 5.74,3.988 | smd 0.508 x 1.473: 12 -3.988,-5.74; 13 -3.2,-5.74; 14 -2.388,-5.74; 15 -1.6,-5.74; 16 -0.787,-5.74; 17 0,-5.74; 18 0.787,-5.74; 19 1.6,-5.74; 20 2.388,-5.74; 21 3.2,-5.74; 22 3.988,-5.74; 34 3.988,5.74; 35 3.2,5.74; 36 2.388,5.74; 37 1.6,5.74; 38 0.787,5.74; 39 0,5.74; 40 -0.787,5.74; 41 -1.6,5.74; 42 -2.388,5.74; 43 -3.2,5.74; 44 -3.988,5.74
SOT23-5 = smd 0.55 x 1.2: 1 -0.95,-1.3; 2 0,-1.3; 3 0.95,-1.3; 4 0.95,1.3; 5 -0.95,1.3
SOT505-1 = smd 0.6 x 1.15: 1 -1.05,-2.175; 4 1.05,-2.175; 5 1.05,2.175; 8 -1.05,2.175 | smd 0.45 x 1.15: 2 -0.325,-2.175; 3 0.325,-2.175; 6 0.325,2.175; 7 -0.325,2.175
QFN-24-4MM2 = smd 1.016 x 0.254: 1 -2.066,1.257; 2 -2.066,0.75; 3 -2.066,0.247; 4 -2.066,-0.287; 5 -2.066,-0.792; 6 -2.066,-1.297; 13 2.086,-1.297; 14 2.086,-0.792; 15 2.086,-0.287; 16 2.086,0.247; 17 2.086,0.75; 18 2.086,1.257 | smd 0.254 x 1.016: 7 -1.267,-2.122; 8 -0.762,-2.122; 9 -0.258,-2.122; 10 0.278,-2.122; 11 0.78,-2.122; 12 1.287,-2.122; 19 1.287,2.082; 20 0.78,2.082; 21 0.278,2.082; 22 -0.258,2.082; 23 -0.762,2.082; 24 -1.267,2.082 | smd 2.616 x 2.616: P$1 0.02,-0.01
16LPCC = smd 0.65 x 0.28: 1 -1.37,0.75; 2 -1.37,0.25; 3 -1.37,-0.25; 4 -1.37,-0.75; 9 1.37,-0.75; 10 1.37,-0.25; 11 1.37,0.25; 12 1.37,0.75 | smd 0.28 x 0.65: 5 -0.75,-1.37; 6 -0.25,-1.37; 7 0.25,-1.37; 8 0.75,-1.37; 13 0.75,1.37; 14 0.25,1.37; 15 -0.25,1.37; 16 -0.75,1.37
RESONATOR-SMD = smd 0.7 x 1.7: 1 -1.2,0; 2 0,0; 3 1.2,0

### Placement (x,y rotation side)
BAT  16.58,35.08 0 top
C1  31.25,41.95 90 top
C2  26.8,40.45 90 bottom
C3  14.55,27.36 270 top
C4  14.6,24.06 90 top
C5  21.35,26.77 90 top
C6  37.02,16.43 270 top
C7  23.06,21.08 90 top
C8  19.78,15.42 0 top
C9  19.73,23.45 0 top
C10  16.23,15.42 180 top
C13  28.35,22.1 0 bottom
C14  29.35,18.9 90 bottom
C15  23.05,19.2 270 bottom
C16  25.85,15.12 180 bottom
C17  25.27,31.26 180 top
C20  24.72,27.76 90 top
C21  30.02,30.96 0 top
C22  27.84,23.86 180 top
C23  36.37,32.83 180 top
J1  10.5,22 90 top
J2  10.5,29.5 90 top
J3  12.78,47.7 0 top
J4  10.75,39.75 90 top
J5  12.9,10.66 0 top
J6  47.09,39.92 90 top
J7  39.83,47.7 0 top
J8  40.64,10.68 0 top
J9  46.84,14.25 90 top
J10  24.2,13 0 top
J11  30.1,13 0 top
J12  55.88,32.01 90 top
J13  55.95,29.34 270 top
J14  32.23,1.7 180 top
LED1  22.56,1.93 180 top
LED2  24.26,2.01 180 top
LED3  34.19,2.01 180 top
LED4  35.77,2.06 180 top
R1  32.37,35.53 180 top
R2  33.8,37.48 180 top
R3  33.8,39.28 180 top
R4  23.83,36.24 270 top
R5  23.81,6.24 90 top
R6  27.13,6.32 90 top
R7  30.63,6.32 90 top
R8  26.85,32.9 90 bottom
R9  23.95,35.65 180 bottom
R10  24.35,38.45 270 bottom
R11  33.73,6.4 90 top
R12  34.31,35.61 180 bottom
R13  46.67,25.58 270 top
R14  46.72,29.13 90 top
R15  22.73,17.97 0 top
R19  19.83,38.08 180 top
R20  16.03,38.08 180 top
U1  38.42,24.93 90 top
U2  26.15,18.85 0 bottom
U3  28.07,27.56 0 top
U5  28.25,38 270 top
U6  29,36.5 270 bottom
U$1  18.08,19.42 0 top
U$2  17.9,26.36 180 top
Y1  39.92,16.58 0 top

### Tracks (layer width: path | path; a pad name or v marks a point on that pad's centre or on a via)
ANT_DEP
  Top 0.089: U1.15 44.32,23.18 44.83,23.18 46.98,21.02 46.98,18.19 J9.4 46.75,17.96 46.75,16.88 J9.3
BAT_MEASURE
  Top 0.5: R20.1 R19.2 23.04,42.14 25.14,42.14 28.22,39.06 28.22,32.9 28.2,32.88 28.2,27.96 28.8,27.36 31.06,27.36 31.89,26.53 U1.37
BOTTOM_EN  (via drill 0.46)
  Top 0.089: v47.65,31.7 47.35,31.4 46.8,31.4 46.4,31.8 46.4,35.58 46.1,35.88 45.44,35.88 41.62,32.05 U1.24
  Bottom 0.089: v47.65,31.7 50.4,28.95 50.4,21.6 49,20.2 49,10.4 47.8,9.2 41.98,9.2 40.64,10.54 J8.1
CAM_NSS
  Top 0.089: R7.2 30.9,7.44 30.9,9.9 33.91,12.91 J11.4 33.91,11.52 34.88,10.55 37.55,10.55 45.2,18.2 45.2,22 44.8,22.4 44.16,22.4 U1.14
CAM_REG_EN  (via drill 0.46)
  Top 0.2: v25.22,16.46 24.64,16.46 23.62,15.44 | 23.62,15.44 23.52,15.34 22.05,15.34 21.72,15.01 21.72,12.34 26.03,8.03 27.02,8.03 27.13,7.92 R6.2 | U1.13 42.91,21.73 42.06,22.58 35.94,22.58 31.95,18.59 31.95,15.44 23.62,15.44
  Bottom 0.2: U2.3 25.2,16.61 25.22,16.59 v25.22,16.46
EAST_EN  (via drill 0.46)
  Top 0.089: v40.2,35.4 40.2,30.75 40.12,30.67 U1.26
  Bottom 0.089: v40.2,35.4 40.2,36.5 34.1,42.6 23.8,42.6 20.4,39.2 20.4,34.6 19.6,33.8 16.2,33.8 10.75,39.25 J4.1
GND  (via drill 0.46)
  Top 0.089: LED1.C 22.59,1.2 24.2,1.2 LED2.C 24.81,1.26 25.26,1.71 25.87,1.71 J14.6 | 34.18,1.2 35.66,1.2 LED4.C | C21.2 30.84,30.96 29.1,32.7 v29.1,32.81 | C17.2 24.42,30.22 v22.88,28.68 | 34.18,1.2 32.8,1.2 32.6,1 27.8,1 27.15,1.65 J14.5 | 34.18,1.2 34.19,1.21 LED3.C | U$2.9 16.6,27.18 16.6,35.06 BAT.1
  Top 0.2: U$2.9 arc90 16.57,27.07 17.17,27.07 arc-90 17.25,27 17.25,26.24 arc-90 17.12,26.11 U$2.11 15.79,26.11 arc-90 15.67,26.24 arc90 15.39,26.51 C3.2 | U$1.1 15.39,20.68 v14.63,19.91 | U$1.18 21.13,20.68 21.36,20.9 21.36,21.31 v21.34,21.34 | U$1.11 18.86,16.68 19.38,16.15 19.57,16.15 19.76,15.96 19.76,15.42 C8.2 | U3.2 28.07,24.49 C22.- | U$1.9 17.82,16.37 17.96,16.23 17.96,14.68 v16.64,13.36
  Top 0.5: C6.2 37.02,14.37 v36.52,13.87 | U1.18 42.23,25.72 v41.81,26.14 | U1.6 38.42,20.95 v39.32,21.84 | U1.39 34.78,24.93 35.56,24.15 v35.57,24.17 | U1.28 38.42,29.01 38.86,28.57 v38.89,28.57 | R3.1 36.23,39.28 v36.57,38.94 | R1.1 33.22,34.11 32.87,33.76 v32.82,33.76 | U5.4 25.32,36.2 v25.32,34.49 | C1.2 32.77,42.8 v33.38,43.41 | C23.2 34.56,32.83 v33.96,32.23 | C5.2 22.41,28.68 v22.88,28.68 | C7.2 23.06,23.68 v22.5,24.23 | C9.2 21.48,23.45 v21.87,23.06 | C10.2 14.02,15.42 v13.26,14.66 | C20.- 24.72,25.43 v24.23,24.94 | C22.- 30.09,23.86 30.78,24.56 v30.78,24.99 | Y1.2 39.92,14.94 v40.36,14.5 | R20.2 14.76,37.65 14.76,35.13 14.81,35.08 BAT.1 | C8.2 20.63,16.18 21.13,16.68 v21.16,16.65
  Bottom 0.089: C13.2 27.5,22.3 | U2.2 26.15,16.3 25,15.15 C16.-
  Bottom 0.152: C13.2 26.75,22.1 26.43,22.42 v26.43,22.68
  Bottom 0.5: U6.4 31.18,34.36 v31.52,34.01 | C14.- 29.35,16.65 v29.79,16.2 29.79,16.18 | R8.1 28.32,32.05 29.08,32.81 v29.1,32.81 | C2.2 28.57,41.3 v29.1,41.83 | C16.- 24.88,15.01 22.99,15.01 22.61,14.63 v22.61,14.48 | C15.2 23.05,16.78 v22.53,16.26
  pour Route15: -2.08,49.15 8.28,59.51 47.98,59.51 59.44,48.06 59.46,48.06 59.46,7.97 48.97,-2.51 7.67,-2.51 -2.06,7.21 -2.06,49.12
  pour Top: -2.15,48.94 8.41,59.51 48.3,59.51 59.51,48.3 59.51,8.07 48.54,-2.9 8.01,-2.9 -2.15,7.26
  pour Bottom: -2.1,49.05 8.41,59.56 48.27,59.56 59.38,48.45 59.38,8.02 48.49,-2.87 8.06,-2.87 -2.1,7.28
LORA_BUSY  (via drill 0.46)
  Top 0.089: v30.4,20.97 30.43,21 32.62,21 U1.44
  Route15 0.089: v30.4,20.97 27.41,20.97 21.15,27.23 12.79,27.23 10.52,29.5 J2.1
LORA_DIO3
  Top 0.089: J2.5 10.5,34.7 9,36.2 9,46.2 11.8,49 21,49 28.8,41.2 28.8,34.6 36.78,26.62 36.78,24.58 35.2,23 34.4,23 34.07,23.33 U1.41
LORA_NRESET  (via drill 0.46)
  Top 0.2: U1.40 34.02,24.14 v34.54,23.62
  Route15 0.089: v34.54,23.62 34.4,23.76 34.4,24.2 26.2,32.4 11.41,32.4 J2.4
LORA_NSS  (via drill 0.46)
  Top 0.089: R11.2 32.95,7.25 v32.8,7.4 32.4,7.4 31.5,6.5 29.9,6.5 27.2,9.2 27.2,11.2 30.77,14.78 v31.3,14.78 | v31.5,21.95 32.46,21.95 U1.43
  Bottom 0.089: v32.8,7.4 21.8,7.4 19.4,9.8 12.8,9.8 11.2,11.4 11.2,31.4 10.56,32.04 J2.3 | v31.5,21.95 31.5,21.5 31.8,21.2 31.8,15.28 v31.3,14.78
MISO
  Top 0.089: U1.2 35.23,19.77 34.8,20.2 34.2,20.2 32.7,18.7 32.7,14.32 32.69,14.32 J11.2
  Route15 0.089: J11.2 31.37,13.41 30.62,14.16 29.23,14.16 29.23,12.5 28.95,12.22 14.38,12.22 12.37,14.22 12.37,21.01 10.78,22.6 10.2,22.6 9.8,23 9.8,25.3 10.31,25.81 J1.4
  Bottom 0.089: J13.4 55.87,25.53 50.05,31.35 50.05,32.75 48.8,34 40.75,34 36.35,38.4 36.2,38.4 33.8,40.8 33.8,41 32.4,42.4 24,42.4 20.6,39 20.6,34.4 19.8,33.6 12.6,33.6 10.8,35.4 10.2,35.4 9.8,35 9.8,26.73 10.5,26.03 J1.4
MOSI
  Top 0.089: J11.3 32.64,13.99 32.88,14.23 32.88,17.64 U1.1
  Route15 0.089: J1.3 12.52,26.56 20.97,26.56 32.64,14.89 J11.3 32.64,13.47 45.97,26.8 J13.3
MPU_INT
  Top 0.089: U1.42 31.13,22.55 29.87,21.29 29.87,17.6 29.47,17.2 19.51,17.2 19.41,17.3 U$1.12
N$1
  Top 0.2: U1.29 37.64,32.42 C23.1
N$2
  Top 0.2: R1.2 31.39,35.66 31.39,36.7 31.14,36.95 U5.5
N$4
  Top 0.2: Y1.1 38.72,17.74 39.22,18.24 U1.7
N$5
  Top 0.2: Y1.3 41.12,17.55 40.54,18.13 40.11,18.13 40.02,18.22 U1.8
N$7
  Top 0.2: C3.1 15.22,28.21 15.87,27.56 15.87,26.87 16.13,26.61 U$2.10
N$8
  Top 0.2: U$1.20 18.86,23.43 C9.1
N$9
  Top 0.2: C8.1 18.35,15.99 U$1.10
N$10
  Top 0.2: U$1.13 21.72,18.12 R15.1
N$11
  Top 0.2: U5.6 30.6,37.5 31.11,37.5 31.12,37.48 R2.2
N$13
  Top 0.2: U$1.8 17.31,15.66 C10.1
N$14
  Bottom 0.2: U6.5 26.85,35.42 R8.2
N$15
  Bottom 0.2: U6.6 25.32,36.17 R9.2
N$16
  Bottom 0.2: U6.7 25.12,36.83 R10.2
N$17
  Top 0.2: U5.7 31.67,38.33 32,38.66 32,39.19 32.09,39.28 R3.2
N$21
  Top 0.2: C4.2 16.28,24.91 16.53,25.17 U$2.12
N$24
  Top 0.2: U5.3 | U5.3 24.41,37.67 R4.1
N$27
  Top 0.2: U3.4 29.02,30.81 C21.1
N$28
  Top 0.2: R5.1 23.12,5.39 22.56,4.84 LED1.A
N$29
  Top 0.2: R6.1 25.84,5.47 25.17,4.8 25.17,3.07 24.86,2.76 LED2.A
N$30
  Bottom 0.2: U2.4 23.15,20.15 C15.1
N$31
  Top 0.2: R7.1 30.63,4.54 31.06,4.11 33.78,4.11 34.19,3.71 LED3.A
N$32
  Top 0.2: R11.1 34.5,4.77 35.48,4.77 35.77,4.49 LED4.A
N$33  (via drill 0.46)
  Top 0.2: C4.1 v17.17,23.21 | v17.17,28.9 17.17,27.75 U$2.8
  Bottom 0.2: v17.17,23.21 v17.17,28.9
N$52
  Bottom 0.2: U6.3 32.9,36.17 R12.1
NORTH_EN  (via drill 0.46)
  Top 0.089: v45.8,35.3 45.8,29.2 44.8,28.2 44.16,28.2 U1.21
  Bottom 0.089: v45.8,35.3 45.8,37.6 47.8,39.6 47.8,45.8 44,49.6 38.84,49.6 38.84,49.58 34.92,45.67 28.42,45.67 25.69,48.4 13.6,48.4 12.9,47.7 J3.1
RESET  (via drill 0.46)
  Top 0.089: v37.6,20.65 36.82,19.87 U1.4
  Route15 0.089: v37.6,20.65 39.11,20.65 45.86,27.4 56.2,27.4 56.6,27 56.6,23.47 56.12,22.99 J13.6
RXD0  (via drill 0.46)
  Top 0.089: v41.5,13.7 34.8,7 34.2,6.4 31.7,6.4 31.6,6.3 30.03,6.3 29.69,5.96 J14.3 | v41.55,17.95 40.81,18.69 U1.9
  Bottom 0.089: v41.5,13.7 41.55,13.75 v41.55,17.95
SCL  (via drill 0.46)
  Top 0.089: U$2.1 19.29,25.6 20.2,25.6 20.8,25 21.8,25 24,27.2 24,29.4 25.2,30.6 25.2,33.4 27,35.2 27,38.05 26.73,38.33 U5.2
  Top 0.2: U1.19 46.57,26.53 R13.1 48.3,26.43 48.76,26.89 48.76,27 | U5.2 24.13,38.33 v22.45,40.01 | J6.3 47.35,42.46 48.76,41.05 | 48.76,41.05 48.76,33.25 | 48.76,33.25 48.76,27 | J7.3 43.44,48.76 46.63,48.76 48.76,46.63 48.76,41.05 | 48.76,33.25 49.24,32.77 v49.3,32.77 | v13.21,31.19 13.21,41.43 | J4.3 12.34,42.29 13.21,41.43 | 13.21,41.43 13.21,44.68 15.32,46.79 J3.3 | 48.76,27 50.06,25.69 50.06,22.89 48.76,21.59 48.76,11.57 46.59,9.4 43.61,9.4 43.18,9.83 J8.3 | U$1.23 17.19,21.63 17.19,22.04 16.88,22.35 v13.19,22.35 v13.18,22.35
  Bottom 0.089: J10.1 24.2,13.15 25.05,14 27,14 27.6,14.6 27.6,18.2 26.6,19.2 12.27,19.2 | 30.4,31.19 30.4,36.55 30.68,36.83 U6.2 | v22.45,40.01 22.33,39.88 22.33,35.79 21.44,34.9 21.44,32.03 20.6,31.19
  Bottom 0.2: U6.2 32.25,36.83 33.27,37.84 v33.27,40.69 | v49.3,32.77 46.43,32.77 44.85,31.19 30.4,31.19 20.6,31.19 v13.21,31.19 13.21,31.04 12.27,30.1 12.27,22.35 | J5.3 15.44,11.43 15.34,11.53 13.16,11.53 12.27,12.42 12.27,19.2 12.27,22.35 | v13.18,22.35 12.27,22.35
SCLK  (via drill 0.46)
  Top 0.089: v35.4,17.95 36,18.55 36,19.15 U1.3
  Route15 0.089: v35.4,17.95 29.85,17.95 20.8,27 10.58,27 J1.5 | J13.5 55.95,24.65 55.2,25.4 55.2,25.8 54.4,26.6 48.4,26.6 33.82,12.02 30.98,12.02 30.1,12.9 J11.1
  Bottom 0.089: v35.4,17.95 35.22,17.95 30.27,13 J11.1
SDA  (via drill 0.46)
  Top 0.089: 11.71,23.98 17.98,23.98 18.6,24.6 18.6,24.94 U$2.16 | J10.2 25.6,12.87 25.6,10 28,7.6 28,6.6 27.8,6.4 25.8,6.4 22.6,9.6 13,9.6 12.2,10.4 12.2,11.2 13.6,12.6 13.62,12.62 | J6.2 47.09,41.29 41.64,46.74 41.64,47.16 J7.2 40.93,47.7 40.22,48.4 39.4,48.4 32.6,41.6 32.6,40.58 v32.44,40.41
  Top 0.2: U1.20 45.76,27.32 R14.1 48.04,28.28 48.23,28.47 48.23,33.09 48.21,33.07 | U5.1 24.85,39.05 v23.52,40.38 | 48.21,33.07 48.21,40.69 47.7,41.19 J6.2 | 48.21,33.07 47.32,32.18 v46.94,32.18 | J4.2 12.04,41.02 12.52,40.54 12.52,38.1 | 12.52,38.1 12.52,30.17 12.7,30 v13.18,30 11.71,28.52 11.71,23.98 11.71,21.72 | 12.52,38.1 10.13,38.1 9.25,38.99 9.25,46 12,48.76 13.8,48.76 14.05,48.51 J3.2 | 11.71,21.72 11.71,14.53 13.62,12.62 14.17,12.07 J5.2 | 11.71,21.72 16.6,21.72 U$1.24
  Bottom 0.089: v32.44,40.41 32.39,40.45 26.35,40.45 24.8,42 24.6,42 23.6,41 23.6,40.44 23.54,40.38 v23.52,40.38
  Bottom 0.2: U6.1 31.99,37.55 32.44,38 v32.44,40.41 | v13.18,30 13.97,30.78 45.54,30.78 v46.94,32.18 46.94,31.53 50.01,28.45 50.01,22.84 48.68,21.51 48.68,10.43 47.7,9.45 42.24,9.45 41.91,9.78 J8.2
SOUTH_EN
  Top 0.089: U1.22 43.84,28.6 41.07,28.6 33.59,21.12 33.59,20.62 33.49,20.52 31.88,20.52 31.87,20.52 30.78,20.52 30.12,19.86 30.12,17.12 30,17 24.84,17 23.44,15.6 21.8,15.6 21.4,15.2 21.4,13 18.2,9.8 13.8,9.8 12.94,10.66 J5.1
SYS_REG_EN  (via drill 0.46)
  Top 0.089: U3.3 29.02,26.58 27.8,27.8 27.8,38.6 26.8,39.6 25.65,39.6 24.25,41 22.47,41 20.68,39.21 R19.1 20.68,37.74 20.82,37.6 20.82,31.57 v22.2,30.2 | R5.2 23.81,7.01 21.8,5 21.8,0.8 22,0.6 36.2,0.6 36.6,1 36.6,7.8 42.98,14.18 46.67,14.18 46.74,14.25 J9.1 J9.2
  Bottom 0.089: v22.2,30.2 34.6,30.2 46,18.8 46,16.53 46.84,15.68 | 46.84,15.68 J9.2 | 46.84,15.68
TOP_EN
  Top 0.089: U1.23 42.41,30.21 39.89,27.7 36.11,27.7 33.4,30.4 33.4,33 37.2,36.8 37.2,45 39.83,47.63 J7.1
TXD0  (via drill 0.46)
  Top 0.089: v37.2,11.1 37.7,11.1 42.15,15.55 42.15,18.11 41.62,18.64 U1.10
  Bottom 0.089: v37.2,11.1 37.2,8.4 30.95,2.15 J14.2
V_CAM
  Bottom 0.5: J10.3 27.1,13.36 27.1,13.38 28.25,14.53 30.03,14.53 30.86,15.36 30.86,19.05 | 30.86,19.05 30.86,19.3 30.41,19.75 C14.+ 28.95,20.15 U2.5 | C13.1 30.3,22.1 31.24,21.16 31.24,19.43 30.86,19.05
V_REG  (via drill 0.46)
  Top 0.089: v47.6,30 46.74,30 R14.2 | v30.8,50.6 30.8,43.8 30.4,43.4 30.4,41.8 31.1,41.1 C1.1 | 25.4,28.61 25.4,22.6 23.06,20.26 C7.1 | 19.91,27.11 20,27.2 20,27.6 21.95,29.55 22.35,29.55 23.6,30.8 23.6,32.2 24.28,32.88 v24.28,32.92
  Top 0.3: U$2.13 17.15,25.34 17.16,25.35 17.16,25.44 17.83,26.11 U$2.2 20.24,26.11 | 20.24,26.11 21.16,26.11 C5.1 | 20.24,26.11 20.17,26.19 20.17,26.85 19.91,27.11 19.9,27.11 U$2.4
  Top 0.5: U1.5 37.64,17.89 C6.1 36.54,16.8 v35.16,16.8 | U5.8 31.25,39.88 C1.1 | C17.1 27.12,30.26 U3.5 26.87,28.61 25.4,28.61 C20.+ | R15.2 23.58,19.71 C7.1 21.7,20.23 v21.61,20.14 | U1.27 39.21,32.35 39.55,32.69 v39.57,32.69 | U1.17 46.47,24.93 R13.2 48.15,24.73 v48.69,25.27 | U1.38 35.27,25.72 v35.76,26.21 | R2.1 36.15,37.48 36.63,37.01 v36.63,36.98 | R4.2 23.82,33.37 v24.28,32.92
  Bottom 0.5: U6.8 26.8,37.58 | 26.8,37.58 C2.1 | 26.8,37.58 26.25,37.58 26.06,37.77 26.06,38.5 25.27,39.3 R10.1 24.35,40.94 v24.74,41.33 | R9.1 22.12,34.67 v22.12,33.78 | R12.2 37.11,35.61 v37.74,36.25
  pour Route2: -2.08,49.12 8.3,59.51 48.01,59.51 59.46,48.06 59.46,8 48.62,-2.84 7.96,-2.84 -2.08,7.21
VBAT  (via drill 0.46, 1)
  Top 0.5: C22.+ 27.12,23.99 U3.1 27.12,27.47 v27.25,27.61
  Top 1.5: BAT.2 19.12,31.25 20.62,29.74 v20.78,29.74
  Bottom 0.089: J1.1 10.4,22.1 10.4,22.4 9.6,23.2 9.6,43.4 10.75,44.55 J4.5 | 26.57,15 26.2,15 25.4,14.2 24.4,14.2 23.4,13.2 23.4,11.89 | 26.57,15 C16.+ | 26.57,15
  Bottom 0.5: U2.1 27.1,15.53 C16.+ | BAT.2 19.12,40.01 | J4.5 14.3,44.83 | 19.12,40.01 14.3,44.83 | 14.3,44.83 16.1,44.83 17.86,46.59 J3.5 | 19.12,40.01 23.84,44.73 36.3,44.73 | 44.88,46.3 37.87,46.3 36.3,44.73 | 44.88,46.3 44.91,46.34 J7.5 | 44.88,46.3 45.79,46.3 J6.5 | J12.2 44.17,34.55 36.3,42.42 36.3,44.73 | 38.43,12.42 38.43,25.78 36.6,27.61 v27.25,27.61 25.45,29.41 21.11,29.41 v20.78,29.74 | J5.5 17.98,11.28 18.59,11.89 23.4,11.89 37.9,11.89 38.43,12.42 | 38.43,12.42 38.78,12.06 45.16,12.06 45.72,11.5 J8.5
WEST_EN
  Top 0.089: J6.1 47.09,37.94 40.82,31.67 40.82,31.64 40.81,31.64 U1.25